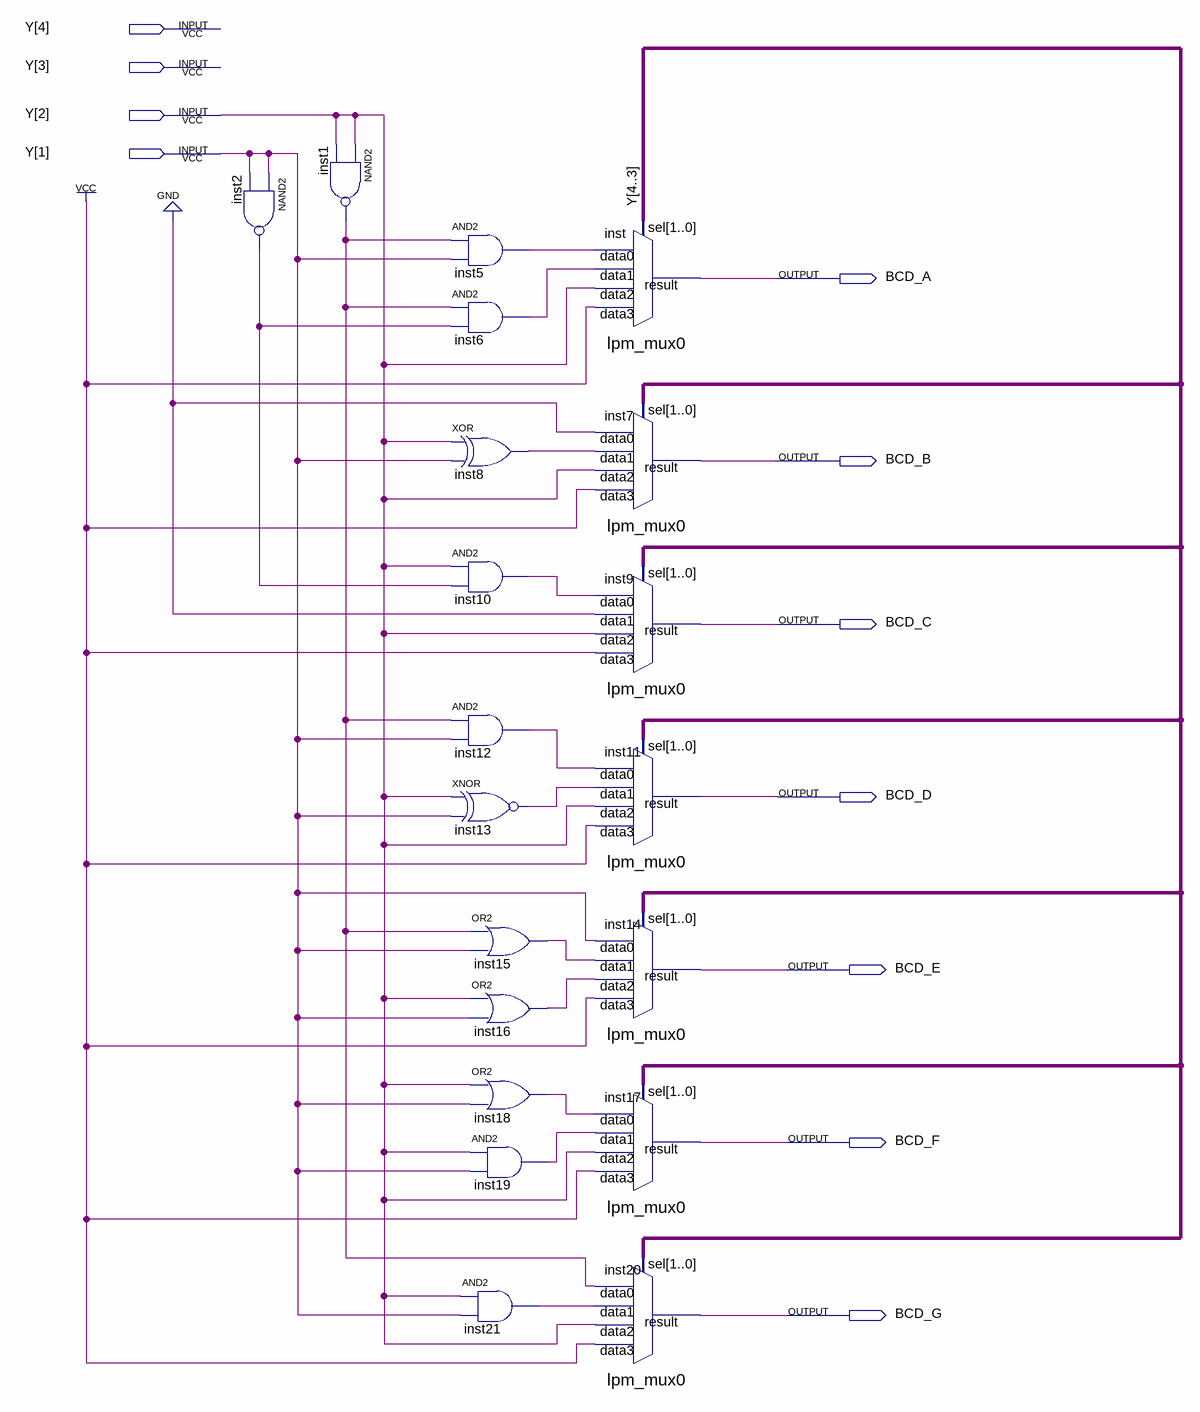
[diagram p0: schematic sheet]
// Quartus schematic Design1_Gudmundsson.bdf as structural Verilog: 20 symbols, 11 pins
module Design1_Gudmundsson (
  input  [4:1] Y,
  output BCD_A,
  output BCD_B,
  output BCD_C,
  output BCD_D,
  output BCD_E,
  output BCD_F,
  output BCD_G
);

  wire inst1_out, inst2_out, inst5_out, inst6_out, inst8_out, inst10_out, inst12_out, inst13_out, inst15_out,
       inst16_out, inst18_out, inst19_out, inst21_out;

  nand inst2 (inst2_out, Y[1], Y[1]);
  nand inst1 (inst1_out, Y[2], Y[2]);
  and inst5 (inst5_out, inst1_out, Y[1]);
  and inst6 (inst6_out, inst1_out, inst2_out);
  xor inst8 (inst8_out, Y[2], Y[1]);
  and inst10 (inst10_out, Y[2], inst2_out);
  and inst12 (inst12_out, inst1_out, Y[1]);
  xnor inst13 (inst13_out, Y[2], Y[1]);
  or inst15 (inst15_out, inst1_out, Y[1]);
  or inst16 (inst16_out, Y[2], Y[1]);
  or inst18 (inst18_out, Y[2], Y[1]);
  and inst19 (inst19_out, Y[2], Y[1]);
  and inst21 (inst21_out, Y[2], Y[1]);
  lpm_mux0 inst (.data3(1'b1), .data2(Y[2]), .data1(inst6_out), .data0(inst5_out), .sel(Y[4:3]), .result(BCD_A));
  lpm_mux0 inst7 (.data3(1'b1), .data2(Y[2]), .data1(inst8_out), .data0(1'b0), .sel(Y[4:3]), .result(BCD_B));
  lpm_mux0 inst9 (.data3(1'b1), .data2(Y[2]), .data1(1'b0), .data0(inst10_out), .sel(Y[4:3]), .result(BCD_C));
  lpm_mux0 inst11 (.data3(1'b1), .data2(Y[2]), .data1(inst13_out), .data0(inst12_out), .sel(Y[4:3]), .result(BCD_D));
  lpm_mux0 inst14 (.data3(1'b1), .data2(inst16_out), .data1(inst15_out), .data0(Y[1]), .sel(Y[4:3]), .result(BCD_E));
  lpm_mux0 inst17 (.data3(1'b1), .data2(Y[2]), .data1(inst19_out), .data0(inst18_out), .sel(Y[4:3]), .result(BCD_F));
  lpm_mux0 inst20 (.data3(1'b1), .data2(Y[2]), .data1(inst21_out), .data0(inst1_out), .sel(Y[4:3]), .result(BCD_G));
endmodule
